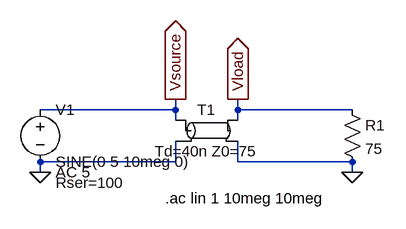
[diagram p0: schematic load.asc]
load.asc, the LTspice schematic file:
Version 4
SHEET 1 880 680
WIRE 224 144 224 128
WIRE 224 144 16 144
WIRE 320 144 320 128
WIRE 496 144 320 144
WIRE 224 160 224 144
WIRE 320 160 320 144
WIRE 224 224 224 192
WIRE 224 224 16 224
WIRE 320 224 320 192
WIRE 496 224 320 224
WIRE 16 240 16 224
WIRE 496 240 496 224
FLAG 496 240 0
FLAG 16 240 0
FLAG 224 128 Vsource
IOPIN 224 128 Out
FLAG 320 128 Vload
IOPIN 320 128 Out
SYMBOL tline 272 176 R0
SYMATTR InstName T1
SYMATTR Value Td=40n Z0=75
SYMBOL res 480 128 R0
SYMATTR InstName R1
SYMATTR Value 75
SYMBOL voltage 16 128 R0
WINDOW 123 24 112 Left 2
WINDOW 39 24 128 Left 2
SYMATTR InstName V1
SYMATTR Value SINE(0 5 10meg 0)
SYMATTR Value2 AC 5
SYMATTR SpiceLine Rser=100
TEXT 208 280 Left 2 !.ac lin 1 10meg 10meg

The netlist it stands for:
* load.asc
T1 Vsource 0 Vload 0 Td=40n Z0=75
R1 Vload 0 75
V1 Vsource 0 SINE(0 5 10meg 0) AC 5 Rser=100
.ac lin 1 10meg 10meg
.backanno
.end

* Results of the author's LTspice run, read from the files saved beside the schematic
* AC Analysis:
*   frequency = 10 M
*   V(vsource) = 2.143 V
*   V(vload) = -1.734 V
*   I(R1) = -23.11 mA
*   Ia(T1) = 28.57 mA
*   Ib(T1) = 23.11 mA
*   Ic(T1) = -28.57 mA
*   Id(T1) = -23.11 mA
*   I(V1) = -28.57 mA